# Altium schematic sheet Sheet 1 - Micro.SchDoc
size A4
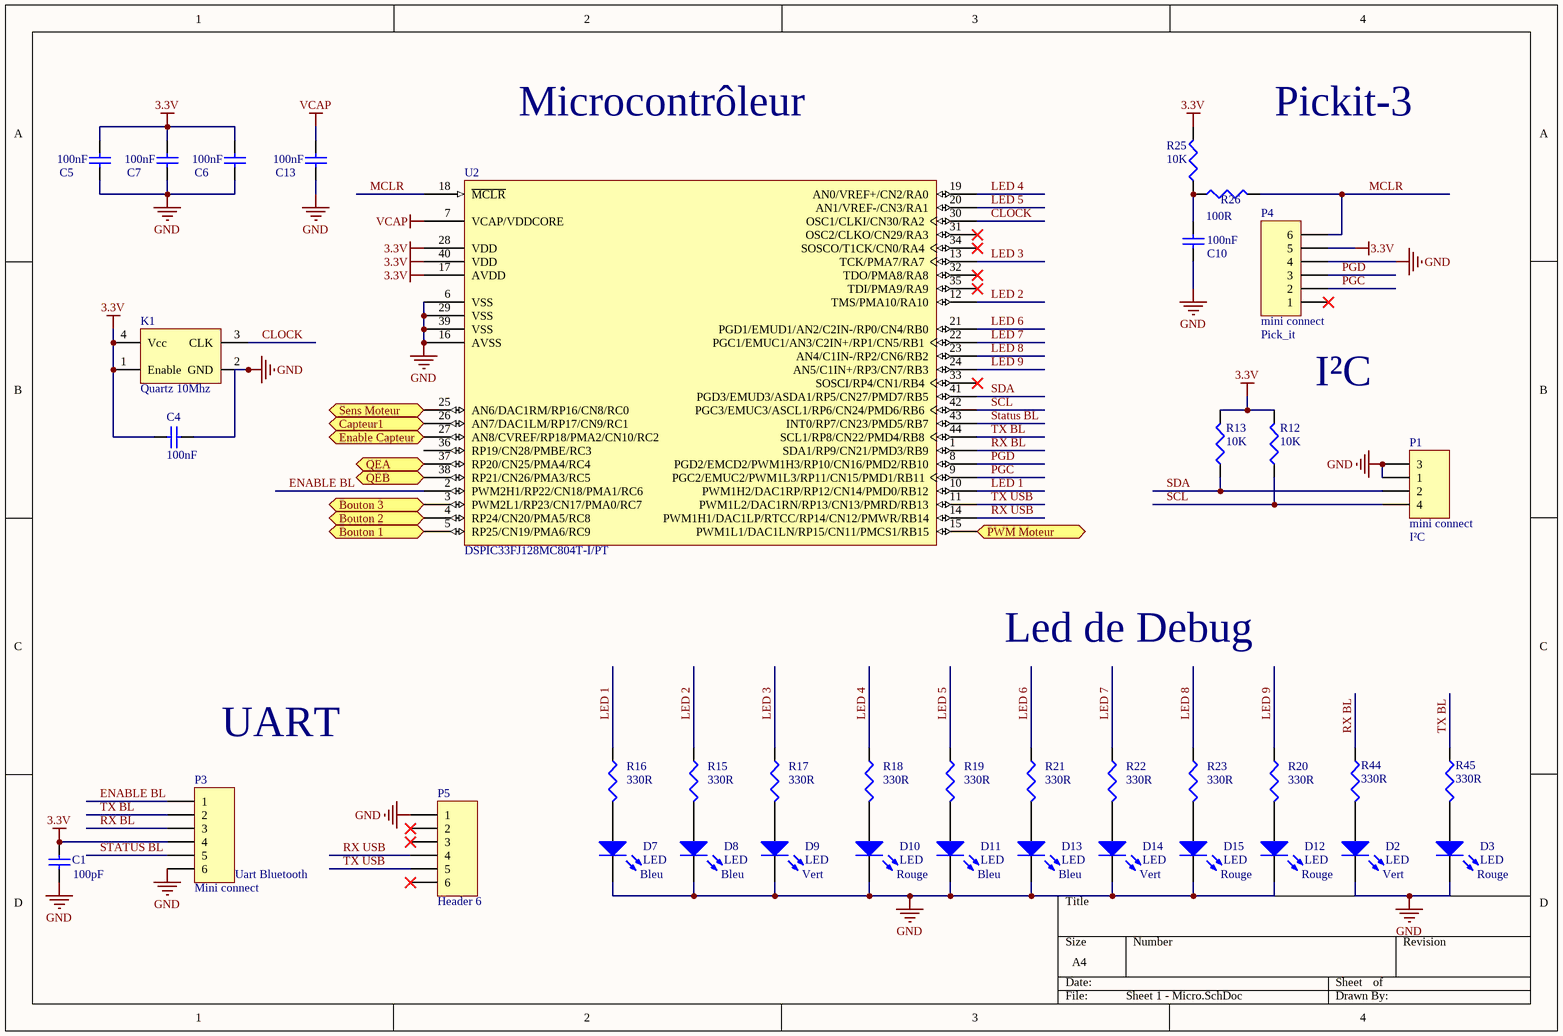
[diagram p0: Sheet 1 - Micro.SchDoc]

## Parts
C1  100pF  [C0805]
C4  100nF  [C0805]
C5  100nF  [C0805]
C6  100nF  [C0805]
C7  100nF  [C0805]
C10  value 100nF  [C0805]  (hidden comment: 0.1uF)
C13  100nF  [C0805]
D2  LED  value Vert  [LED 0805]
D3  LED  value Rouge  [LED 0805]
D7  LED  value Bleu  [LED 0805]
D8  LED  value Bleu  [LED 0805]
D9  LED  value Vert  [LED 0805]
D10  LED  value Rouge  [LED 0805]
D11  LED  value Bleu  [LED 0805]
D12  LED  value Rouge  [LED 0805]
D13  LED  value Bleu  [LED 0805]
D14  LED  value Vert  [LED 0805]
D15  LED  value Rouge  [LED 0805]
K1  Quartz 10Mhz  [IQXO-70]
P1  mini connect  value1: I²C  [690367280476]
P3  Mini connect  VALUE1: Uart Bluetooth  [690367280676]
P4  mini connect  value1: Pick_it  [690367280676]
P5  Header 6  [HDR1X6]
R12  10K  [0805]
R13  10K  [0805]
R15  330R  [0805]
R16  330R  [0805]
R17  330R  [0805]
R18  330R  [0805]
R19  330R  [0805]
R20  330R  [0805]
R21  330R  [0805]
R22  330R  [0805]
R23  330R  [0805]
R25  10K  [0805]
R26  100R  [0805]
R44  330R  [0805]
R45  330R  [0805]
U2  DSPIC33FJ128MC804T-I/PT  [TQFP-PT44_N]

## Ports
Bouton 1, Bouton 2, Bouton 3, Capteur1, Enable Capteur, PWM Moteur, QEA, QEB, Sens Moteur

## Nets
3.3V: C1.2 C4.2 C5.2 C6.2 C7.2 K1.1(Enable) K1.4(Vcc) P3.4 P4.5 R12.2 R13.2 R25.2 U2.17(AVDD) U2.28(VDD) U2.40(VDD)
GND: C1.1 C4.1 C5.1 C6.1 C7.1 C10.1 C13.1 D2.2(K) D3.2(K) D7.2(K) D8.2(K) D9.2(K) D10.2(K) D11.2(K) D12.2(K) D13.2(K) D14.2(K) D15.2(K) K1.2(GND) P1.1 P1.3 P3.6 P4.4 P5.1 U2.6(VSS) U2.16(AVSS) U2.29(VSS) U2.39(VSS)
VCAP: C13.2 U2.7(VCAP/VDDCORE)
Bouton 1: U2.5(RP25/CN19/PMA6/RC9) ; port Bouton 1
Bouton 2: U2.4(RP24/CN20/PMA5/RC8) ; port Bouton 2
Bouton 3: U2.3(PWM2L1/RP23/CN17/PMA0/RC7) ; port Bouton 3
Capteur1: U2.26(AN7/DAC1LM/RP17/CN9/RC1) ; port Capteur1
CLOCK: K1.3(CLK) U2.30(OSC1/CLKI/CN30/RA2)
ENABLE BL: P3.1 U2.2(PWM2H1/RP22/CN18/PMA1/RC6)
Enable Capteur: U2.27(AN8/CVREF/RP18/PMA2/CN10/RC2) ; port Enable Capteur
LED 1: R16.1 U2.10(PWM1H2/DAC1RP/RP12/CN14/PMD0/RB12)
LED 2: R15.1 U2.12(TMS/PMA10/RA10)
LED 3: R17.1 U2.13(TCK/PMA7/RA7)
LED 4: R18.1 U2.19(AN0/VREF+/CN2/RA0)
LED 5: R19.1 U2.20(AN1/VREF-/CN3/RA1)
LED 6: R21.1 U2.21(PGD1/EMUD1/AN2/C2IN-/RP0/CN4/RB0)
LED 7: R22.1 U2.22(PGC1/EMUC1/AN3/C2IN+/RP1/CN5/RB1)
LED 8: R23.1 U2.23(AN4/C1IN-/RP2/CN6/RB2)
LED 9: R20.1 U2.24(AN5/C1IN+/RP3/CN7/RB3)
MCLR: P4.6 R26.2 U2.18(~{MCLR})
PGC: P4.2 U2.9(PGC2/EMUC2/PWM1L3/RP11/CN15/PMD1/RB11)
PGD: P4.3 U2.8(PGD2/EMCD2/PWM1H3/RP10/CN16/PMD2/RB10)
PWM Moteur: U2.15(PWM1L1/DAC1LN/RP15/CN11/PMCS1/RB15) ; port PWM Moteur
QEA: U2.37(RP20/CN25/PMA4/RC4) ; port QEA
QEB: U2.38(RP21/CN26/PMA3/RC5) ; port QEB
RX BL: P3.3 R44.1 U2.1(SDA1/RP9/CN21/PMD3/RB9)
RX USB: P5.4 U2.14(PWM1H1/DAC1LP/RTCC/RP14/CN12/PMWR/RB14)
SCL: P1.4 R12.1 U2.42(PGC3/EMUC3/ASCL1/RP6/CN24/PMD6/RB6)
SDA: P1.2 R13.1 U2.41(PGD3/EMUD3/ASDA1/RP5/CN27/PMD7/RB5)
Sens Moteur: U2.25(AN6/DAC1RM/RP16/CN8/RC0) ; port Sens Moteur
Status BL: P3.5 U2.43(INT0/RP7/CN23/PMD5/RB7)
TX BL: P3.2 R45.1 U2.44(SCL1/RP8/CN22/PMD4/RB8)
TX USB: P5.5 U2.11(PWM1L2/DAC1RN/RP13/CN13/PMRD/RB13)
NetC10_2: C10.2 R25.1 R26.1
NetD2_1: D2.1(A) R44.2
NetD3_1: D3.1(A) R45.2
NetD7_1: D7.1(A) R16.2
NetD8_1: D8.1(A) R15.2
NetD9_1: D9.1(A) R17.2
NetD10_1: D10.1(A) R18.2
NetD11_1: D11.1(A) R19.2
NetD12_1: D12.1(A) R20.2
NetD13_1: D13.1(A) R21.2
NetD14_1: D14.1(A) R22.2
NetD15_1: D15.1(A) R23.2

Not connected (* = marked no-connect by the designer): P4 1*; P5 2* 3* 6*; U2 31(OSC2/CLKO/CN29/RA3)* 32(TDO/PMA8/RA8)* 33(SOSCI/RP4/CN1/RB4)* 34(SOSCO/T1CK/CN0/RA4)* 35(TDI/PMA9/RA9)* 36(RP19/CN28/PMBE/RC3)

## Notes on the sheet
- Microcontrôleur
- Pickit-3
- I²C
- Led de Debug
- UART

## Library data of the parts
C1 C4-C7 C10 C13 = Cap: Capacitor 0805; Published: 8-Jun-2000; LatestRevisionDate: 17-Jul-2002; LatestRevisionNote: Re-released for DXP Platform.; PackageReference: RAD-0.3; Publisher: Altium Limited
  C1: Value: 100pF
  C4-C7 C13: value: 100nF
D2 D3 D7-D15 = LED2: Typical RED, GREEN, YELLOW, AMBER GaAs LED 0805; Published: 8-Jun-2000; LatestRevisionDate: 17-Jul-2002; LatestRevisionNote: Re-released for DXP Platform.; PackageVersion: Feb-2002; PackageReference: 3.2X1.6X1.1; Publisher: Altium Limited
K1 = OSCILLATEUR: Oscillateur quartz; part number: 478-8625; value: 10Mhz; Supplier Part Number 1: 478-8625; Supplier 1: Farnell
P1 = MHDR1X4: Header, 4-Pin; value: 690367280476; LatestRevisionDate: 17-Jul-2002; LatestRevisionNote: Re-released for DXP Platform.; Publisher: Altium Limited; Supplier Part Number 1: 378-4710; Supplier 1: Farnell
P3 P4 = MHDR1X6: Header, 6-Pin; value: 690367280676; LatestRevisionDate: 17-Jul-2002; LatestRevisionNote: Re-released for DXP Platform.; Publisher: Altium Limited; Supplier Part Number 1: 129-1787; Supplier 1: Farnell
P5 = Header 6: Header, 6-Pin; value: 690367280676; LatestRevisionDate: 17-Jul-2002; LatestRevisionNote: Re-released for DXP Platform.; Publisher: Altium Limited; Supplier Part Number 1: 129-1787; Supplier 1: Farnell
R12 R13 = Res3: Resistor 0805; Value: 1K; Published: 8-Jun-2000; LatestRevisionDate: 29-May-2009; LatestRevisionNote: IPC-7351 Footprint Added.; PackageReference: J1-0603; Publisher: Altium Limited; PackageDescription: Chip Resistor
R15 R16 R19 R21 R25 R26 = Res3: Resistor 0805; Published: 8-Jun-2000; LatestRevisionDate: 29-May-2009; LatestRevisionNote: IPC-7351 Footprint Added.; PackageReference: J1-0603; Publisher: Altium Limited; PackageDescription: Chip Resistor
  R15 R16 R19 R21: Value: 330R
  R25: Value: 10K
  R26: value: 100R
R17 R18 R20 R22 R23 R44 R45 = Res3: Resistor 0805; Value: 470R; Published: 8-Jun-2000; LatestRevisionDate: 29-May-2009; LatestRevisionNote: IPC-7351 Footprint Added.; PackageReference: J1-0603; Publisher: Altium Limited; PackageDescription: Chip Resistor
U2 = DSPIC33FJ128MC804T-I/PT: High-Performance 16-bit Digital Signal Controller, 128 KB Flash, 16 KB RAM, 44-Pin TQFP, Industrial Temperature, Tape and Reel; FirstPublished: 29-Jan-2009; LatestRevisionDate: 02-Dec-2009; LatestRevisionNote: Updated to datasheet revision D, Nov-2009; DatasheetVersion: revD, Nov-2009; PackageVersion: revBB, Aug-2009; PackageReference: TQFP-PT44; Publisher: Altium Limited; PackageDescription: 44-Lead Plastic Thin Quad Flatpack (PT) - 10x10x1mm Body, 2.00mm [TQFP]; Supplier 1: farnell; Supplier Part Number 1: 157-6810; Supplier 2: Newark; Supplier Part Number 2: 39M8148; Code_JEDEC: MS-026; ComponentLink1Description: Datasheet; ComponentLink1URL: http://ww1.microchip.com/downloads/en/DeviceDoc/70291D.pdf; ComponentLink2Description: Packaging Specification; ComponentLink2URL: http://www.microchip.com/stellent/groups/techpub_sg/documents/packagingspec/en012702.pdf; ComponentLink3Description: Microchip.com Home; ComponentLink3URL: http://www.microchip.com/